# Altium schematic sheet Sheet1.SchDoc
size A4
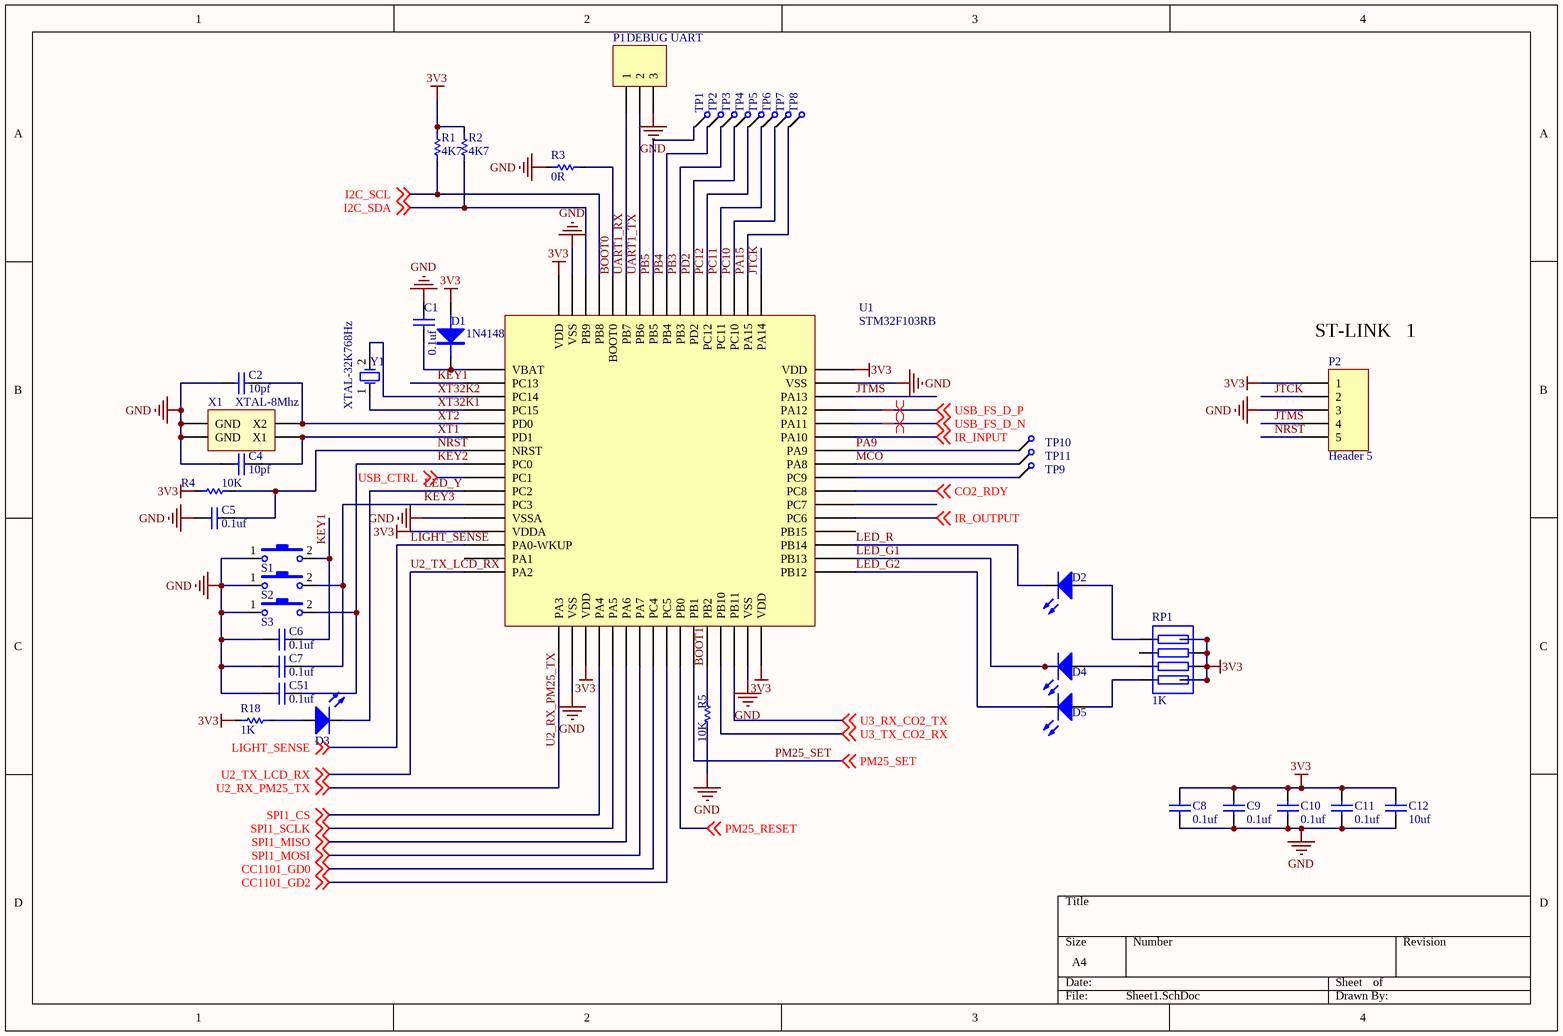
[diagram p0: Sheet1.SchDoc]

## Parts
C1  0.1uf  [C0603]
C2  10pf  [C0603]
C4  10pf  [C0603]
C5  0.1uf  [C0603]
C6  0.1uf  [C0603]
C7  0.1uf  [C0603]
C8  0.1uf  [C0603]
C9  0.1uf  [C0603]
C10  0.1uf  [C0603]
C11  0.1uf  [C0603]
C12  10uf  [C1206]
C51  0.1uf  [C0603]
D1  1N4148  [D0805]
D2  红色LED  [LED0603]  (value not drawn)
D3  黄色LED  [LED0603]  (value not drawn)
D4  红色LED  [LED0603]  (value not drawn)
D5  红色LED  [LED0603]  (value not drawn)
P1  DEBUG UART  [HDR1X3]
P2  Header 5  [HDR1X5]
R1  4K7  [R0603]
R2  4K7  [R0603]
R3  0R  [R0603]
R4  10K  [R0603]
R5  10K  [R0603]
R18  1K  [R0603]
RP1  1K  [R_PACK4_SMD]
S1  SW-PB  [SWPB_SMD_90D_48_18_15]  (value not drawn)
S2  SW-PB  [SWPB_SMD_90D_48_18_15]  (value not drawn)
S3  SW-PB  [SW2*1Small]  (value not drawn)
TP1  TestPoint  [TP_0.8]  (value not drawn)
TP2  TestPoint  [TP_0.8]  (value not drawn)
TP3  TestPoint  [TP_0.8]  (value not drawn)
TP4  TestPoint  [TP_0.8]  (value not drawn)
TP5  TestPoint  [TP_0.8]  (value not drawn)
TP6  TestPoint  [TP_0.8]  (value not drawn)
TP7  TestPoint  [TP_0.8]  (value not drawn)
TP8  TestPoint  [TP_0.8]  (value not drawn)
TP9  TestPoint  [TP_0.8]  (value not drawn)
TP10  TestPoint  [TP_0.8]  (value not drawn)
TP11  TestPoint  [TP_0.8]  (value not drawn)
U1  STM32F103RB  [STM32F103RB]
X1  XTAL-8Mhz  [XTAL5032]
Y1  XTAL-32K768Hz  [CRY_S]

## Nets
3V3: C8.2 C9.2 C10.2 C11.2 C12.2 D1.1(A) P2.1 R1.2 R2.2 R4.2 R18.1 RP1.1 RP1.3 RP1.5 RP1.7 U1.13(VDDA) U1.19(VDD) U1.32(VDD) U1.48(VDD) U1.64(VDD)
GND: C1.2 C2.1 C4.2 C5.2 C6.2 C7.2 C8.1 C9.1 C10.1 C11.1 C12.1 C51.1 P1.3 P2.3 R3.1 R5.1 S1.1 S2.1 S3.1 U1.12(VSSA) U1.18(VSS) U1.31(VSS) U1.47(VSS) U1.63(VSS) X1.2(GND) X1.4(GND)
BOOT0: R3.2 U1.60(BOOT0)
BOOT1: R5.2 U1.28(PB2)
CC1101_GD0: U1.24(PC4) ; off-sheet CC1101_GD0
CC1101_GD2: U1.25(PC5) ; off-sheet CC1101_GD2
CO2_RDY: U1.39(PC8) ; off-sheet CO2_RDY
I2C_SCL: R1.1 U1.61(PB8) ; off-sheet I2C_SCL
I2C_SDA: R2.1 U1.62(PB9) ; off-sheet I2C_SDA
IR_INPUT: U1.43(PA10) ; off-sheet IR_INPUT
IR_OUTPUT: U1.37(PC6) ; off-sheet IR_OUTPUT
JTCK: P2.2 U1.49(PA14)
JTMS: P2.4 U1.46(PA13)
KEY1: C6.1 S1.2 U1.2(PC13)
KEY2: C51.2 S3.2 U1.8(PC0)
KEY3: C7.1 S2.2 U1.11(PC3)
LED_G1: D4.2(K) U1.34(PB13)
LED_G2: D5.2(K) U1.33(PB12)
LED_R: D2.2(K) U1.35(PB14)
LED_Y: D3.2(K) U1.10(PC2)
LIGHT_SENSE: U1.14(PA0-WKUP) ; off-sheet LIGHT_SENSE
MCO: TP11.1 U1.41(PA8)
NRST: C5.1 P2.5 R4.1 U1.7(NRST)
PA9: TP10.1 U1.42(PA9)
PA15: TP8.1 U1.50(PA15)
PB3: TP3.1 U1.55(PB3)
PB4: TP2.1 U1.56(PB4)
PB5: TP1.1 U1.57(PB5)
PC10: TP7.1 U1.51(PC10)
PC11: TP6.1 U1.52(PC11)
PC12: TP5.1 U1.53(PC12)
PD2: TP4.1 U1.54(PD2)
PM25_RESET: U1.26(PB0) ; off-sheet PM25_RESET
PM25_SET: U1.27(PB1) ; off-sheet PM25_SET
SPI1_CS: U1.20(PA4) ; off-sheet SPI1_CS
SPI1_MISO: U1.22(PA6) ; off-sheet SPI1_MISO
SPI1_MOSI: U1.23(PA7) ; off-sheet SPI1_MOSI
SPI1_SCLK: U1.21(PA5) ; off-sheet SPI1_SCLK
U2_RX_PM25_TX: U1.17(PA3) ; off-sheet U2_RX_PM25_TX
U2_TX_LCD_RX: U1.16(PA2) ; off-sheet U2_TX_LCD_RX
U3_RX_CO2_TX: U1.30(PB11) ; off-sheet U3_RX_CO2_TX
U3_TX_CO2_RX: U1.29(PB10) ; off-sheet U3_TX_CO2_RX
UART1_RX: P1.1 U1.59(PB7)
UART1_TX: P1.2 U1.58(PB6)
USB_CTRL: U1.9(PC1) ; off-sheet USB_CTRL
USB_FS_D_N: U1.44(PA11) ; off-sheet USB_FS_D_N
USB_FS_D_P: U1.45(PA12) ; off-sheet USB_FS_D_P
XT1: C4.1 U1.6(PD1) X1.1(X1)
XT2: C2.2 U1.5(PD0) X1.3(X2)
XT32K1: U1.4(PC15) Y1.1(OSC1)
XT32K2: U1.3(PC14) Y1.2(OSC2)
NetC1_1: C1.1 D1.2(K) U1.1(VBAT)
NetD2_1: D2.1(A) RP1.8
NetD3_1: D3.1(A) R18.2
NetD4_1: D4.1(A) RP1.4
NetD5_1: D5.1(A) RP1.2
NetTP9_1: TP9.1 U1.40(PC9)

Not connected (* = marked no-connect by the designer): RP1 6; U1 15(PA1) 36(PB15) 38(PC7)

## Layout directives
differential pair: USB_FS_D_N, USB_FS_D_P

## Notes on the sheet
- (near P2) ST-LINK   1

## Library data of the parts
C1 C5-C12 C51 = Cap: Capacitor; Option: 25V  X7R
  C1 C5-C11 C51: Value: 0.1uf
  C12: Value: 10uf
C2 C4 = Cap: Capacitor; Published: 8-Jun-2000; LatestRevisionDate: 17-Jul-2002; LatestRevisionNote: Re-released for DXP Platform.; PackageReference: RAD-0.3; Publisher: Altium Limited; Value: 10pf
D1 = DIODE: Value: 1N4148
D2-D5 = LED: Typical INFRARED GaAs LED; Published: 8-Jun-2000; LatestRevisionDate: 08-Jul-2005; LatestRevisionNote: Mech Layer 1 removed.; PackageReference: LED-0; Publisher: Altium Limited
  D2 D4 D5: Color: 红色LED
  D3: Color: 黄色LED
P1 = Header 3: Header, 3-Pin; LatestRevisionDate: 17-Jul-2002; LatestRevisionNote: Re-released for DXP Platform.; Publisher: Altium Limited
P2 = Header 5: Header, 5-Pin; LatestRevisionDate: 17-Jul-2002; LatestRevisionNote: Re-released for DXP Platform.; Publisher: Altium Limited
R1-R5 R18 = Res: Published: 8-Jun-2000; LatestRevisionDate: 17-Jul-2002; LatestRevisionNote: Re-released for DXP Platform.; PackageReference: AXIAL-0.3; Publisher: Altium Limited
  R1 R2: Value: 4K7
  R3: Value: 0R
  R4 R5: Value: 10K
  R18: Value: 1K
RP1 = RESPACK4: Value: 1K
S1-S3 = SW-PB: Switch; Published: 24-Mar-1999; LatestRevisionDate: 17-Jul-2002; LatestRevisionNote: Re-released for DXP Platform.; PackageReference: SPST-2; Publisher: Altium Limited
TP1-TP11 = TestPoint: 一个测试点
X1 = XTALSMT
Y1 = XTAL: Crystal Oscillator 32K; Published: 8-Jun-2000; LatestRevisionDate: 17-Jul-2002; LatestRevisionNote: Re-released for DXP Platform.; PackageReference: R38; Publisher: Altium Limited